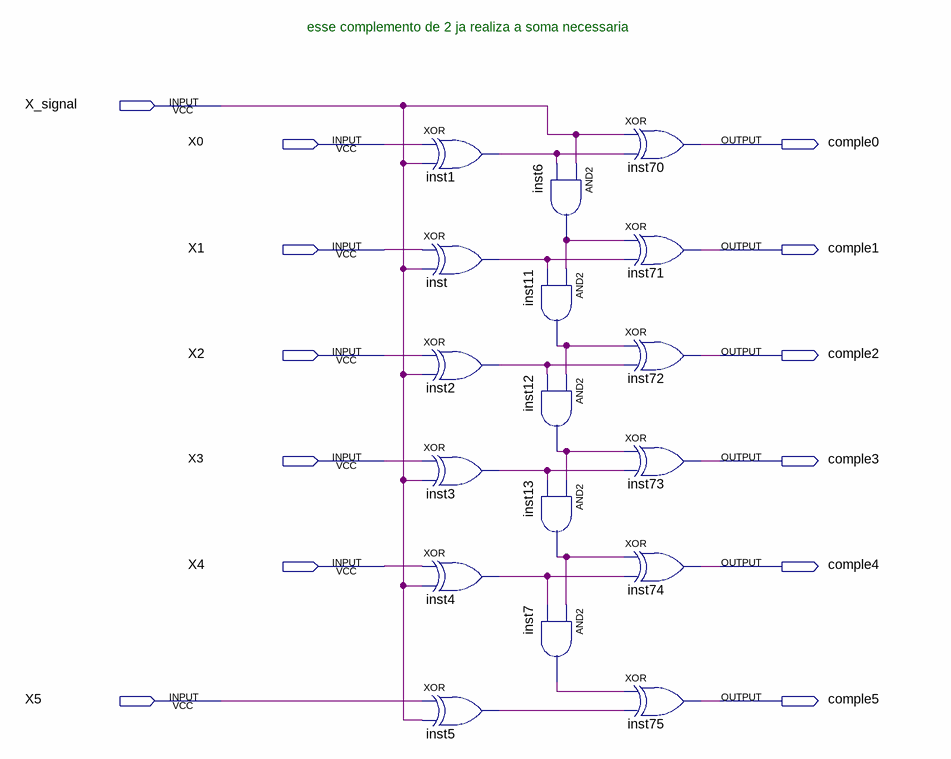
[diagram p0: schematic sheet]
// Quartus schematic complemento_2_original.bdf as structural Verilog: 17 symbols, 13 pins
module complemento_2_original (
  input  X_signal,
  input  X0,
  input  X1,
  input  X2,
  input  X3,
  input  X4,
  input  X5,
  output comple0,
  output comple1,
  output comple2,
  output comple3,
  output comple4,
  output comple5
);

  wire inst1_out, inst2_out, inst3_out, inst4_out, inst5_out, inst6_out, inst7_out, inst11_out, inst12_out,
       inst13_out, inst_out;

  xor inst1 (inst1_out, X0, X_signal);
  xor inst (inst_out, X1, X_signal);
  xor inst2 (inst2_out, X2, X_signal);
  xor inst3 (inst3_out, X3, X_signal);
  xor inst4 (inst4_out, X4, X_signal);
  xor inst5 (inst5_out, X5, X_signal);
  and inst11 (inst11_out, inst6_out, inst_out);
  and inst12 (inst12_out, inst11_out, inst2_out);
  and inst13 (inst13_out, inst12_out, inst3_out);
  and inst7 (inst7_out, inst13_out, inst4_out);
  and inst6 (inst6_out, X_signal, inst1_out);
  xor inst70 (comple0, X_signal, inst1_out);
  xor inst71 (comple1, inst6_out, inst_out);
  xor inst72 (comple2, inst11_out, inst2_out);
  xor inst73 (comple3, inst12_out, inst3_out);
  xor inst74 (comple4, inst13_out, inst4_out);
  xor inst75 (comple5, inst7_out, inst5_out);

  // Notes on the sheet:
  //   esse complemento de 2 ja realiza a soma necessaria
endmodule
